# Altium schematic sheet SFPplusConn.SchDoc
size A4
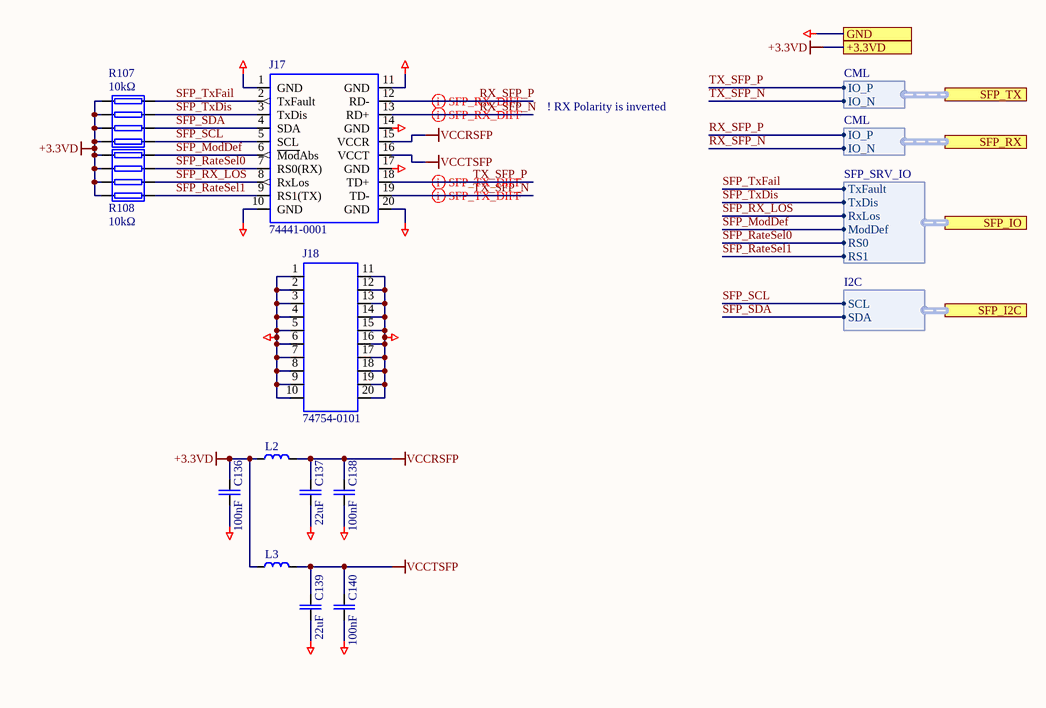
[diagram p0: SFPplusConn.SchDoc]

## Parts
C136  100nF  [CAPC1608N]
C137  22uF  [CAPC2012N]
C138  100nF  [CAPC1608N]
C139  22uF  [CAPC2012N]
C140  100nF  [CAPC1608N]
J17  74441-0001  [MOLEX_74441-0001]
J18  74754-0101  [MOLEX_74737-0111]
L2  BLM21PG221SN1  [INDC2012N]  (value not drawn)
L3  BLM21PG221SN1  [INDC2012N]  (value not drawn)
R107  value 10kΩ  [CAY16-J4]  (hidden comment: CAY16-1002F4LF)
R108  value 10kΩ  [CAY16-J4]  (hidden comment: CAY16-1002F4LF)

## Ports
+3.3VD, GND, SFP_I2C (harness I2C), SFP_IO (harness SFP_SRV_IO), SFP_RX (harness CML), SFP_TX (harness CML)

## Harnesses
CML: IO_N, IO_P
SFP_SRV_IO: TxDis, TxFault, RS0, RS1, ModDef, RxLos
I2C: SDA, SCL

## Nets
+3.3VD: C136.2 L2.1 L3.1 R107.1 R107.2 R107.3 R107.4 R108.1 R108.2 R108.3 R108.4 ; port +3.3VD
GND: C136.1 C137.1 C138.1 C139.1 C140.1 J17.1(GND) J17.10(GND) J17.11(GND) J17.14(GND) J17.17(GND) J17.20(GND) J18.1 J18.2 J18.3 J18.4 J18.5 J18.6 J18.7 J18.8 J18.9 J18.10 J18.11 J18.12 J18.13 J18.14 J18.15 J18.16 J18.17 J18.18 J18.19 J18.20 ; port GND
VCCRSFP: C137.2 C138.2 J17.15(VCCR) L2.2
VCCTSFP: C139.2 C140.2 J17.16(VCCT) L3.2
RX_SFP_N: J17.13(RD+) ; port SFP_RX.IO_N
RX_SFP_P: J17.12(RD-) ; port SFP_RX.IO_P
SFP_ModDef: J17.6(~{Mod}Abs) R108.8 ; port SFP_IO.ModDef
SFP_RateSel0: J17.7(RS0(RX)) R108.7 ; port SFP_IO.RS0
SFP_RateSel1: J17.9(RS1(TX)) R108.5 ; port SFP_IO.RS1
SFP_RX_LOS: J17.8(RxLos) R108.6 ; port SFP_IO.RxLos
SFP_SCL: J17.5(SCL) R107.5 ; port SFP_I2C.SCL
SFP_SDA: J17.4(SDA) R107.6 ; port SFP_I2C.SDA
SFP_TxDis: J17.3(TxDis) R107.7 ; port SFP_IO.TxDis
SFP_TxFail: J17.2(TxFault) R107.8 ; port SFP_IO.TxFault
TX_SFP_N: J17.19(TD-) ; port SFP_TX.IO_N
TX_SFP_P: J17.18(TD+) ; port SFP_TX.IO_P

## Layout directives
differential pair; rule Differential Pairs Routing [Pref Gap = 0.175mm    Min Gap  = 0.075mm    Max Gap  = 0.5mmPref Width = 0.25mm    Min Width  = 0.075mm    Max Width  = 0.5mm]: RX_SFP_N, RX_SFP_P, TX_SFP_N, TX_SFP_P

## Notes on the sheet
- ! RX Polarity is inverted

## Library data of the parts
C136 C138 C140 = CAPC: Generic ceramic SMD capacitor; Pkg: 0603; Maintainer: Evgeniy Kotov; SMD Solders: 2; THD Solders: 0; PartField: 100nF; Last Change Data: 06.03.2017; Release Date: 06.03.2017; Value: 100nF
C137 C139 = CAPC: Generic ceramic SMD capacitor; Pkg: 0805; Maintainer: Evgeniy Kotov; SMD Solders: 2; THD Solders: 0; PartField: 22uF; Last Change Data: 06.03.2017; Release Date: 06.03.2017; Value: 22uF
J17 = MOLEX-74441-0001: CONN SFP+ RCPT 20POS SLD R/A SMD; Pkg: SMD SFP conn; SMD Solders: 20; THD Solders: 0; RoHSCompliant: True; ComponentLink3URL: http://www.molex.com/pdm_docs/sd/747540101_sd.pdf; Width: 49 mm; Height: 10.85 mm; Mounting Technology: Through Hole; ComponentLink2Description: Datasheet; ComponentLink3Description: Package Specification; DatasheetVersion: Rev. Jul-15; Package Quantity: 1152; PackageDescription: CONN SFP+ RCPT 20POS SLD R/A SMD; Radiation Hardening: No; PackageVersion: Rev. J, 02/2015; ComponentLink1Description: Manufacturer URL; PartNumber: 74441-0001; ComponentLink1URL: http://www.molex.com/; Packaging: Tray; Length: 15.9 mm; ComponentLink2URL: http://www.molex.com/webdocs/datasheets/pdf/en-us/0747540101_IO_CONNECTORS.pdf; Value: 74441-0001; PartField: 74441-0001
J18 = MOLX-74754-0101: SFP+ Cage, Single Port, Height 10.85 mm, Tail Height 3.05 mm, -40 to 85 degC, RoHS, Tray; Pkg: SFP cage; SMD Solders: 0; THD Solders: 20; RoHSCompliant: True; ComponentLink3URL: http://www.molex.com/pdm_docs/sd/747540101_sd.pdf; Width: 49 mm; Height: 10.85 mm; Mounting Technology: Through Hole; ComponentLink2Description: Datasheet; ComponentLink3Description: Package Specification; DatasheetVersion: Rev. Jul-15; Package Quantity: 1152; PackageDescription: SFP+ Cage, Single Port, Height 10.85 mm, Tail Height 3.05 mm; Radiation Hardening: No; PackageVersion: Rev. J, 02/2015; ComponentLink1Description: Manufacturer URL; PartNumber: 74754-0101; ComponentLink1URL: http://www.molex.com/; Packaging: Tray; Length: 15.9 mm; ComponentLink2URL: http://www.molex.com/webdocs/datasheets/pdf/en-us/0747540101_IO_CONNECTORS.pdf; Value: 74754-0101; PartField: 74754-0101
L2 L3 = BLM21PG221SN1: Ferrite Beads, 0805, 220 Ohm, 2A; Pkg: 0805; Vendor: Murata; Maintainer: Evgeniy Kotov; SMD Solders: 2; THD Solders: 0; DC Current: 200mA; Tolerance: 25%; DC Resistance: 50mΩ; PartField: BLM21PG221SN1; Release Date: 30.03.2017; Last Change Data: 30.03.2017; Temperature Range: -55°C to +125°C; Value: BLM21PG221SN1
R107 R108 = RESPACK4: Maintainer: Anton Pavlenko; Pkg: SMD 8pin; SMD Solders: 8; THD Solders: 0; PartField: CAY16-1002F4LF; Last Change Data: 16.05.2019; Release Date: 16.05.2019